# Altium schematic sheet Sheet2.SchDoc
size A4
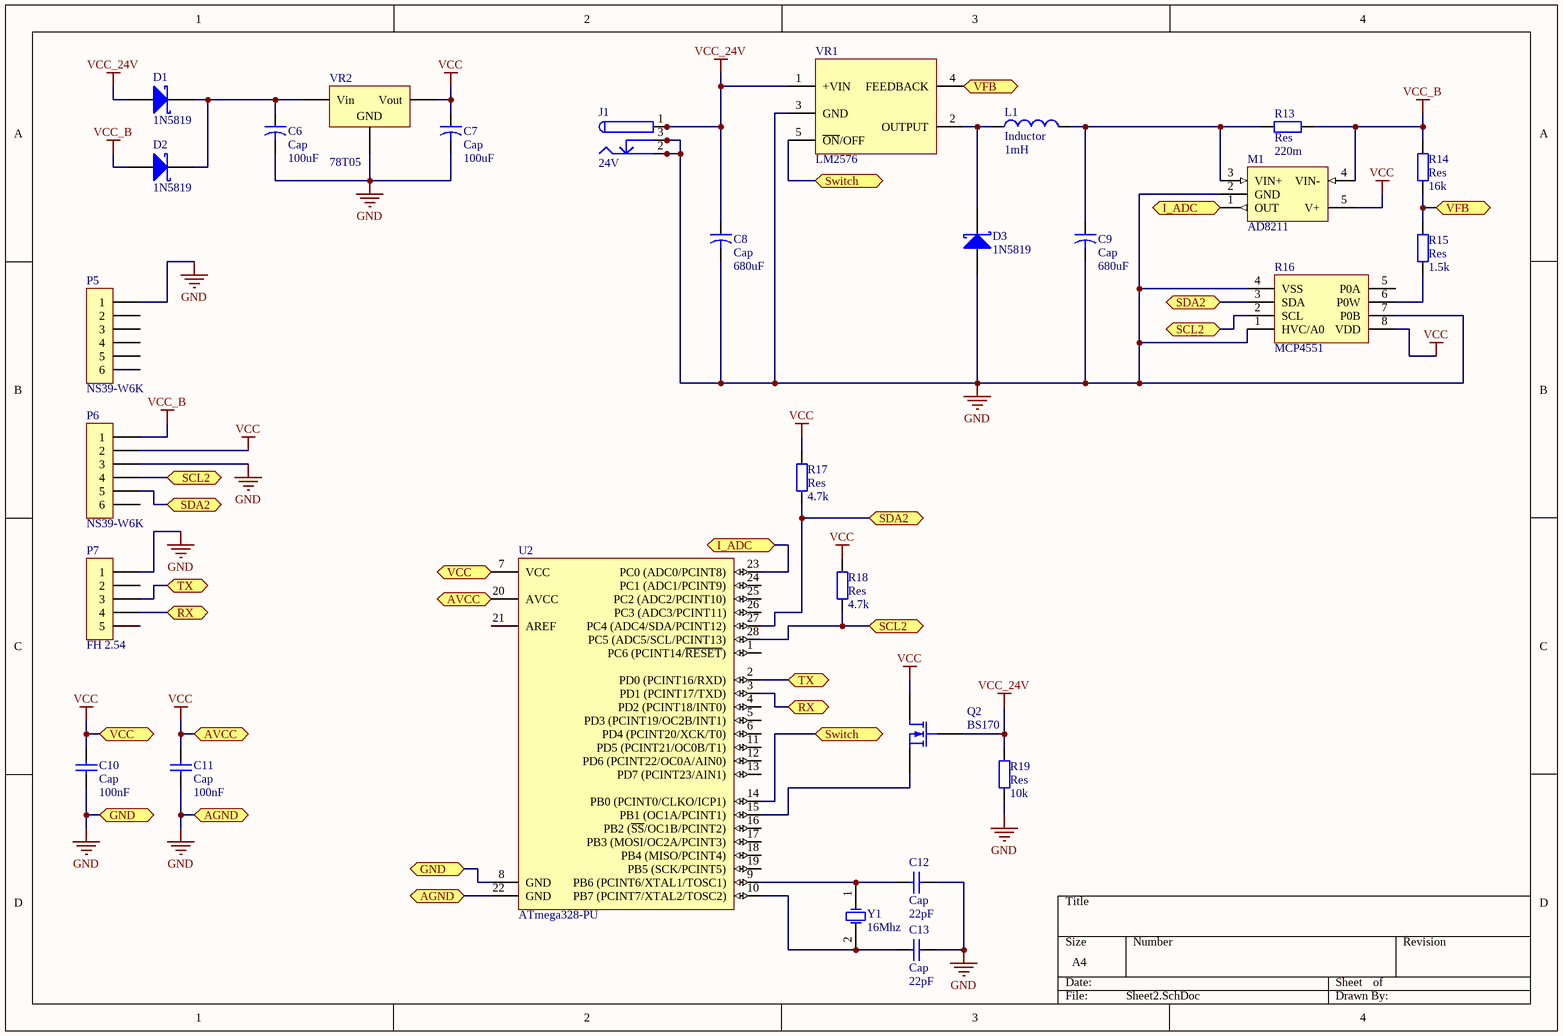
[diagram p0: Sheet2.SchDoc]

## Parts
C6  Cap  value 100uF  [CAPR5-4X5]
C7  Cap  value 100uF  [CAPR5-4X5]
C8  Cap  value 680uF  [CAPR5-4X5]
C9  Cap  value 680uF  [CAPR5-4X5]
C10  Cap  value 100nF  [C0805]
C11  Cap  value 100nF  [C0805]
C12  Cap  value 22pF  [C0805]
C13  Cap  value 22pF  [C0805]
D1  1N5819  [SOT-23_N]
D2  1N5819  [SOT-23_N]
D3  1N5819  [SOT-23_N]
J1  24V  [KLD-0202]
L1  Inductor  value 1mH  [0402-A]
M1  AD8211
P5  NS39-W6K  [NS39-W6K]
P6  NS39-W6K  [NS39-W6K]
P7  FH 2.54
Q2  BS170  [E3]
R13  Res  value 220m  [6-0805_N]
R14  Res  value 16k  [6-0805_N]
R15  Res  value 1.5k  [6-0805_N]
R16  MCP4551
R17  Res  value 4.7k  [6-0805_N]
R18  Res  value 4.7k  [6-0805_N]
R19  Res  value 10k  [6-0805_N]
U2  ATmega328-PU  [28P3]
VR1  LM2576
VR2  78T05  [TO-220AB]
Y1  16Mhz  [R38]

## Ports
AGND, AVCC, GND, I_ADC, RX, SCL2, SDA2, Switch, TX, VCC, VFB

## Nets
GND: C6.2 C7.2 C8.2 C9.2 C10.2 C11.2 C12.2 C13.2 D3.1(A) J1.2 J1.2A J1.2B J1.3 J1.3A J1.3B M1.2(GND) P5.1 P6.3 P7.1 R16.1(HVC/A0) R16.4(VSS) R16.7(P0B) R19.1 U2.8(GND) U2.22(GND) VR1.3(GND) VR2.2(GND) ; port GND, port AGND
VCC: C7.1 C10.1 C11.1 M1.5(V+) P6.2 Q2.1(D) R16.8(VDD) R17.2 R18.2 U2.7(VCC) U2.20(AVCC) VR2.3(Vout) ; port VCC, port AVCC
VCC_24V: C8.1 D1.1(A) J1.1 J1.1A J1.1B Q2.2(G) R19.2 VR1.1(+VIN)
VCC_B: D2.1(A) M1.4(VIN-) P6.1 R13.1 R14.2
I_ADC: M1.1(OUT) U2.23(PC0_(ADC0/PCINT8)) ; port I_ADC
RX: P7.4 U2.3(PD1_(PCINT17/TXD)) ; port RX
SCL2: P6.4 R16.2(SCL) R18.1 U2.28(PC5_(ADC5/SCL/PCINT13)) ; port SCL2
SDA2: P6.5 R16.3(SDA) R17.1 U2.27(PC4_(ADC4/SDA/PCINT12)) ; port SDA2
Switch: U2.14(PB0_(PCINT0/CLKO/ICP1)) VR1.5(~{ON}/OFF) ; port Switch
TX: P7.3 U2.2(PD0_(PCINT16/RXD)) ; port TX
VFB: R14.1 R15.2 VR1.4(FEEDBACK) ; port VFB
NetC6_1: C6.1 D1.3(K) D2.3(K) VR2.1(Vin)
NetC9_1: C9.1 L1.2 M1.3(VIN+) R13.2
NetC12_1: C12.1 U2.9(PB6_(PCINT6/XTAL1/TOSC1)) Y1.1(OSC1)
NetC13_1: C13.1 U2.10(PB7_(PCINT7/XTAL2/TOSC2)) Y1.2(OSC2)
NetD3_3: D3.3(K) L1.1 VR1.2(OUTPUT)
NetQ2_3: Q2.3(S) U2.15(PB1_(OC1A/PCINT1))
NetR15_1: R15.1 R16.6(P0W)

Not connected (* = marked no-connect by the designer): P5 2 3 4 5 6; P6 6; P7 2 5; R16 5(P0A); U2 1(PC6_(PCINT14/~{RESET})) 4(PD2_(PCINT18/INT0)) 5(PD3_(PCINT19/OC2B/INT1)) 6(PD4_(PCINT20/XCK/T0)) 11(PD5_(PCINT21/OC0B/T1)) 12(PD6_(PCINT22/OC0A/AIN0)) 13(PD7_(PCINT23/AIN1)) 16(PB2_(~{SS}/OC1B/PCINT2)) 17(PB3_(MOSI/OC2A/PCINT3)) 18(PB4_(MISO/PCINT4)) 19(PB5_(SCK/PCINT5)) 21(AREF) 24(PC1_(ADC1/PCINT9)) 25(PC2_(ADC2/PCINT10)) 26(PC3_(ADC3/PCINT11))

## Library data of the parts
C6-C9 = Cap2: Capacitor; Published: 23-Sep-2002; PackageReference: CAPR5-4X5; Publisher: Altium Limited; PackageDescription: Capacitor; 2 Leads
C10-C13 = Cap: Capacitor; Published: 8-Jun-2000; LatestRevisionDate: 17-Jul-2002; LatestRevisionNote: Re-released for DXP Platform.; PackageReference: RAD-0.3; Publisher: Altium Limited; PackageDescription: Radial Cap, Thru-Hole; 2 Leads; 0.3 in Pin Spacing
D1-D3 = Diode BAT17: Silicon RF Schottky Diode for Mixer Applications in the VHF/UHF Range; Note: Pin 2 is not connected and not drawn.; Published: 21-Mar-2003; LatestRevisionDate: 29-May-2009; LatestRevisionNote: IPC-7351 Footprint Added.; DatasheetVersion: Oct-1999; PackageVersion: Sep-2001; PackageReference: SOT-23; Publisher: Altium Limited; PackageDescription: 3-Pin SOT-23 Package 0.95 mm Pitch, 2.5 mm Lead Span; ComponentLink1Description: Manufacturer Link; ComponentLink1URL: http://www.infineon.com/; ComponentLink2Description: Datasheet; ComponentLink2URL: http://www.infineon.com/upload/Document/cmc_upload/documents/009/363/bat17series.pdf
J1 = PWR2.5: Low Voltage Power Supply Connector; Published: 17-Dec-2003; DatasheetDocument: 09-May-2002; Publisher: Altium Limited; ComponentLink1Description: Manufacturer Link; ComponentLink1URL: http://domino.kycon.com/internet/Products.html
L1 = Inductor: Code_IEC: 1005; Published: 8-Jun-2000; LatestRevisionDate: 29-May-2009; LatestRevisionNote: IPC-7351 Footprint Added.; PackageReference: 0402-A; Publisher: Altium Limited; PackageDescription: Chip Inductor; Code_JEITA: 0402
M1 = AD8211: Current Shunt Monitor
P5 P6 = NS39-W6K: Socket
P7 = FH 2.54: Socket
Q2 = MOSFET-N: N-Channel MOSFET; Published: 8-Jun-2000; LatestRevisionDate: 17-Jul-2002; LatestRevisionNote: Re-released for DXP Platform.; PackageVersion: 1995/1996; PackageReference: E3; Publisher: Altium Limited; PackageDescription: TO, Flat Index; 3 In-Line, Axial Leads; Body Dia. 4.6mm; Lead Dia. 0.5 mm (max)
R13-R15 R17-R19 = Res2: Resistor; Published: 8-Jun-2000; LatestRevisionDate: 17-Jul-2002; LatestRevisionNote: Re-released for DXP Platform.; PackageReference: AXIAL-0.4; Publisher: Altium Limited; PackageDescription: Axial Device, Thru-Hole; 2 Leads; 0.4 in Pin Spacing
R16 = MCP4551: Digital POT
U2 = ATmega328-PU: 8-bit AVR Microcontroller, 32KB Flash, 1KB EEPROM, 2KB SRAM, 28-pin PDIP, Industrial Grade (-40°C to 85°C); Published: 1-Apr-2010; DatasheetVersion: revA, Jan-2010; PackageVersion: revB, Sep-2001; PackageReference: 28P3; Publisher: Altium Limited; PackageDescription: 28-lead (0.300"/7.62mm Wide) Plastic Dual Inline Package (PDIP); Supplier 1: Digi-Key; Supplier Part Number 1: ATMEGA328-PU-ND; Supplier 2: Mouser; Supplier Part Number 2: 556-ATMEGA328-PU; ComponentLink1Description: Manufacturer Link; ComponentLink1URL: http://www.atmel.com/products/avr/default.asp?; ComponentLink2Description: ATmega48A/48PA/88A/88PA/168A/168PA/328/328P Datasheet; ComponentLink2URL: http://www.atmel.com/dyn/resources/prod_documents/8271.pdf; ComponentLink3Description: ATmega48A/48PA/88A/88PA/168A/168PA/328/328P Summary; ComponentLink3URL: http://www.atmel.com/dyn/resources/prod_documents/8271S.pdf; ComponentLink4Description: Atmel.com Home; ComponentLink4URL: http://www.atmel.com
VR1 = LM2576: Step-Down Voltage Regulator
VR2 = Volt Reg: Voltage Regulator; Published: 24-Mar-1999; LatestRevisionDate: 29-May-2009; LatestRevisionNote: IPC-7351 Footprint Added.; PackageReference: D2PAK; Publisher: Altium Limited; PackageDescription: 3-Pin Transistor Outline Package 2.54 mm Pitch, 15.1 mm Lead Span
Y1 = XTAL: Crystal Oscillator; Published: 8-Jun-2000; LatestRevisionDate: 17-Jul-2002; LatestRevisionNote: Re-released for DXP Platform.; PackageReference: R38; Publisher: Altium Limited; PackageDescription: Crystal, Thru-Hole; 2 Leads; Body 3.1 x 8.2 mm (Dia.xH)